# Altium schematic sheet UM202.SchDoc
size A4
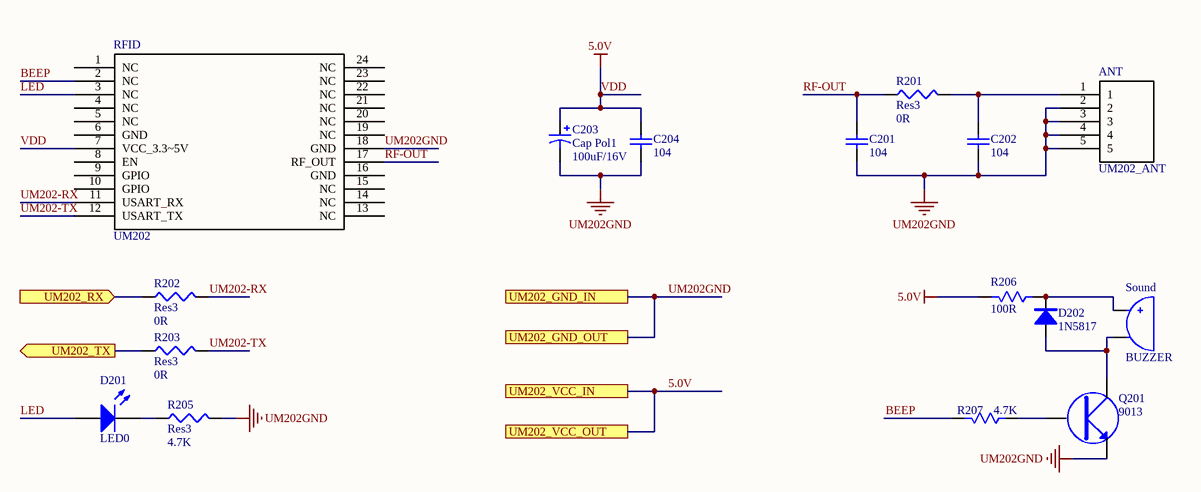
[diagram p0: UM202.SchDoc]

## Parts
ANT  UM202_ANT
C201  104  [RAD-0.3]
C202  104  [RAD-0.3]
C203  Cap Pol1  value 100uF/16V  [RB7.6-15]
C204  104  [RAD-0.3]
D201  LED0  [LED-0]
D202  1N5817  [SOD-323]
Q201  9013
R201  Res3  value 0R  [J1-0603]
R202  Res3  value 0R  [J1-0603]
R203  Res3  value 0R  [J1-0603]
R205  Res3  value 4.7K  [J1-0603]
R206  100R  [0603R-M]
R207  4.7K  [0603R-M]
RFID  UM202
Sound  BUZZER  [BUZZER-SMD]

## Ports
UM202_GND_IN, UM202_GND_OUT, UM202_RX (in), UM202_TX (out), UM202_VCC_IN, UM202_VCC_OUT

## Nets
5.0V: C203.1 C204.2 R206.1 RFID.7(VCC_3.3~5V) ; port UM202_VCC_IN, port UM202_VCC_OUT  [also labelled VDD]
UM202GND: ANT.2 ANT.3 ANT.4 ANT.5 C201.1 C202.1 C203.2 C204.1 Q201.2 R205.2 RFID.18(GND) ; port UM202_GND_IN, port UM202_GND_OUT
BEEP: R207.1 RFID.2(NC)
LED: D201.1(A) RFID.3(NC)
RF-OUT: C201.2 R201.1 RFID.17(RF_OUT)
UM202-RX: R202.2 RFID.11(USART_RX)
UM202-TX: R203.2 RFID.12(USART_TX)
UM202_RX: R202.1 ; port UM202_RX
UM202_TX: R203.1 ; port UM202_TX
NetANT_1: ANT.1 C202.2 R201.2
NetD201_2: D201.2(K) R205.1
NetD202_A: D202.A Q201.3 Sound.2(B)
NetD202_C: D202.C R206.2 Sound.1(A)
NetQ201_1: Q201.1 R207.2

Not connected (* = marked no-connect by the designer): RFID 1(NC) 4(NC) 5(NC) 6(GND) 8(EN) 9(GPIO) 10(GPIO) 13(NC) 14(NC) 15(NC) 16(GND) 19(NC) 20(NC) 21(NC) 22(NC) 23(NC) 24(NC)

## Library data of the parts
C201 C202 C204 = Cap: Capacitor; Published: 8-Jun-2000; LatestRevisionDate: 17-Jul-2002; LatestRevisionNote: Re-released for DXP Platform.; PackageReference: RAD-0.3; Publisher: Altium Limited; PackageDescription: Radial Cap, Thru-Hole; 2 Leads; 0.3 in Pin Spacing
C203 = Cap Pol1: Polarized Capacitor (Radial); Published: 8-Jun-2000; LatestRevisionDate: 17-Jul-2002; LatestRevisionNote: Re-released for DXP Platform.; PackageReference: RB7.6-15; Publisher: Altium Limited; PackageDescription: Polarized Capacitor (Radial); 2 Leads
D201 = LED0: Typical INFRARED GaAs LED; Published: 8-Jun-2000; LatestRevisionDate: 08-Jul-2005; LatestRevisionNote: Mech Layer 1 removed.; PackageReference: LED-0; Publisher: Altium Limited; PackageDescription: LED; 2 Leads
D202 = DIODE
R201-R203 R205 = Res3: Resistor; Published: 8-Jun-2000; LatestRevisionDate: 29-May-2009; LatestRevisionNote: IPC-7351 Footprint Added.; PackageReference: J1-0603; Publisher: Altium Limited; PackageDescription: Chip Resistor
R206 R207 = RES1